# Altium schematic sheet Main.SchDoc
size A
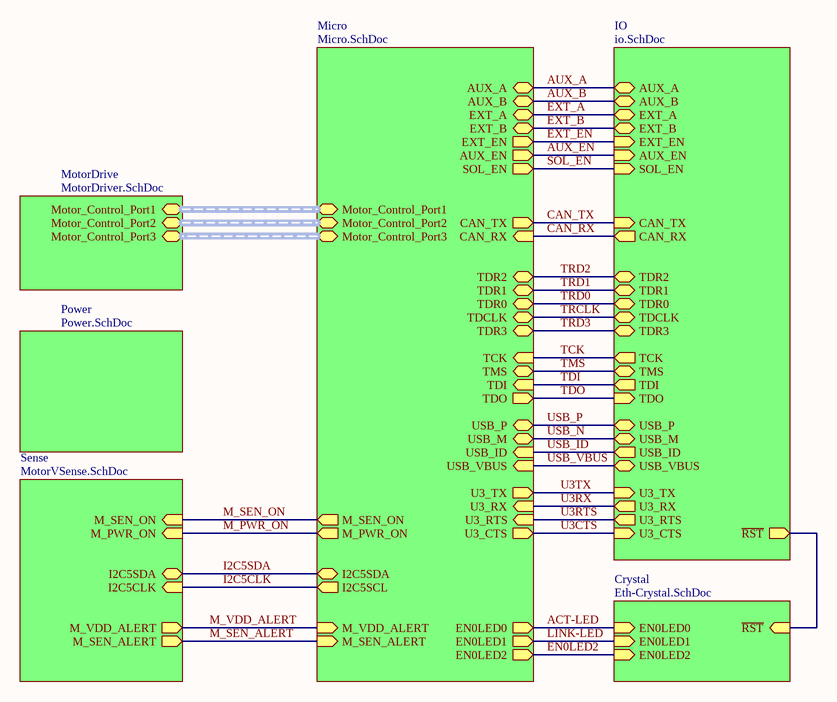
[diagram p0: Main.SchDoc]

## Sub-sheets
Crystal = Eth-Crystal.SchDoc: EN0LED0 (in), EN0LED1 (in), EN0LED2 (in), ~{RST} (in)
IO = io.SchDoc: CAN_TX (in), CAN_RX (out), TCK (out), TMS (bidir), TDI (out), TDO (in), U3_RTS (out), U3_CTS (in), U3_TX (in), U3_RX (out), USB_P (bidir), USB_M (bidir), USB_ID (out), ~{RST} (out), TDR1 (bidir), TDR0 (bidir), TDR2 (bidir), TDCLK (bidir), TDR3 (bidir), SOL_EN (in), USB_VBUS, AUX_EN (in), EXT_EN (in), AUX_A (bidir), AUX_B (bidir), EXT_A (bidir), EXT_B (bidir)
Micro = Micro.SchDoc: CAN_TX (out), CAN_RX (in), Motor_Control_Port1 (harness MCP), Motor_Control_Port2 (harness MCP), Motor_Control_Port3 (harness MCP), TCK (in), TMS (bidir), TDI (in), TDO (out), EN0LED0 (out), EN0LED1 (out), EN0LED2 (out), USB_P (bidir), USB_M (bidir), USB_ID (in), USB_VBUS (in), M_PWR_ON (out), M_SEN_ON (out), U3_TX (out), U3_RX (in), U3_RTS (in), U3_CTS (out), M_VDD_ALERT (in), M_SEN_ALERT (in), TDR3 (bidir), TDR0 (bidir), TDCLK (bidir), TDR2 (bidir), TDR1 (bidir), I2C5SDA (bidir), I2C5SCL (out), SOL_EN (out), AUX_A (bidir), AUX_B (bidir), EXT_A (bidir), EXT_B (bidir), EXT_EN (out), AUX_EN (out)
MotorDrive = MotorDriver.SchDoc: Motor_Control_Port1 (harness MCP), Motor_Control_Port2 (harness MCP), Motor_Control_Port3 (harness MCP)
Power = Power.SchDoc: no entries
Sense = MotorVSense.SchDoc: M_SEN_ON (in), M_PWR_ON (in), I2C5CLK (in), M_VDD_ALERT (out), M_SEN_ALERT (out), I2C5SDA (bidir)

## Nets
ACT-LED: sheet Micro/EN0LED0, sheet Crystal/EN0LED0
AUX_A: sheet Micro/AUX_A, sheet IO/AUX_A
AUX_B: sheet Micro/AUX_B, sheet IO/AUX_B
AUX_EN: sheet Micro/AUX_EN, sheet IO/AUX_EN
CAN_RX: sheet Micro/CAN_RX, sheet IO/CAN_RX
CAN_TX: sheet Micro/CAN_TX, sheet IO/CAN_TX
EN0LED2: sheet Micro/EN0LED2, sheet Crystal/EN0LED2
EXT_A: sheet Micro/EXT_A, sheet IO/EXT_A
EXT_B: sheet Micro/EXT_B, sheet IO/EXT_B
EXT_EN: sheet Micro/EXT_EN, sheet IO/EXT_EN
I2C5CLK: sheet Micro/I2C5SCL, sheet Sense/I2C5CLK
I2C5SDA: sheet Micro/I2C5SDA, sheet Sense/I2C5SDA
LINK-LED: sheet Micro/EN0LED1, sheet Crystal/EN0LED1
M_PWR_ON: sheet Micro/M_PWR_ON, sheet Sense/M_PWR_ON
M_SEN_ALERT: sheet Micro/M_SEN_ALERT, sheet Sense/M_SEN_ALERT
M_SEN_ON: sheet Micro/M_SEN_ON, sheet Sense/M_SEN_ON
M_VDD_ALERT: sheet Micro/M_VDD_ALERT, sheet Sense/M_VDD_ALERT
SOL_EN: sheet Micro/SOL_EN, sheet IO/SOL_EN
TCK: sheet Micro/TCK, sheet IO/TCK
TDI: sheet Micro/TDI, sheet IO/TDI
TDO: sheet Micro/TDO, sheet IO/TDO
TMS: sheet Micro/TMS, sheet IO/TMS
TRCLK: sheet Micro/TDCLK, sheet IO/TDCLK
TRD0: sheet Micro/TDR0, sheet IO/TDR0
TRD1: sheet Micro/TDR1, sheet IO/TDR1
TRD2: sheet Micro/TDR2, sheet IO/TDR2
TRD3: sheet Micro/TDR3, sheet IO/TDR3
U3CTS: sheet Micro/U3_CTS, sheet IO/U3_CTS
U3RTS: sheet Micro/U3_RTS, sheet IO/U3_RTS
U3RX: sheet Micro/U3_RX, sheet IO/U3_RX
U3TX: sheet Micro/U3_TX, sheet IO/U3_TX
USB_ID: sheet Micro/USB_ID, sheet IO/USB_ID
USB_N: sheet Micro/USB_M, sheet IO/USB_M
USB_P: sheet Micro/USB_P, sheet IO/USB_P
USB_VBUS: sheet Micro/USB_VBUS, sheet IO/USB_VBUS
(unnamed): sheet Crystal/~{RST}, sheet IO/~{RST}

## Buses and harness runs
harness sheet Micro/Motor_Control_Port1 = sheet MotorDrive/Motor_Control_Port1
harness sheet Micro/Motor_Control_Port2 = sheet MotorDrive/Motor_Control_Port2
harness sheet Micro/Motor_Control_Port3 = sheet MotorDrive/Motor_Control_Port3